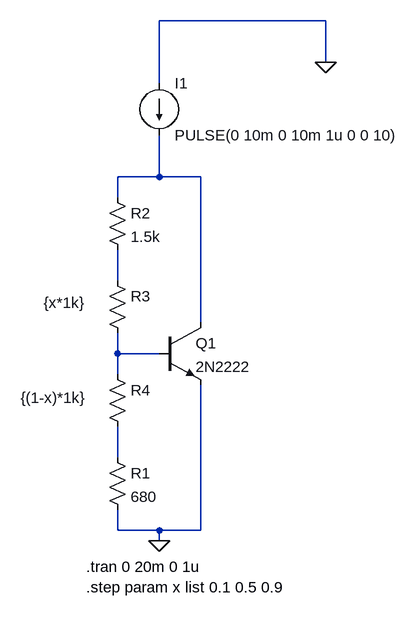
[diagram p0: schematic rubber_diode.asc]
rubber_diode.asc, the LTspice schematic file:
Version 4
SHEET 1 880 680
WIRE 432 -304 176 -304
WIRE 432 -240 432 -304
WIRE 176 -208 176 -304
WIRE 176 -64 176 -128
WIRE 176 -64 112 -64
WIRE 240 -64 176 -64
WIRE 112 -32 112 -64
WIRE 112 96 112 48
WIRE 240 160 240 -64
WIRE 112 208 112 176
WIRE 176 208 112 208
WIRE 112 240 112 208
WIRE 112 368 112 320
WIRE 112 480 112 448
WIRE 176 480 112 480
WIRE 240 480 240 256
WIRE 240 480 176 480
WIRE 176 496 176 480
FLAG 176 496 0
FLAG 432 -240 0
SYMBOL npn2 176 160 R0
SYMATTR InstName Q1
SYMATTR Value 2N2222
SYMBOL res 96 352 R0
SYMATTR InstName R1
SYMATTR Value 680
SYMBOL res 96 -48 R0
SYMATTR InstName R2
SYMATTR Value 1.5k
SYMBOL res 96 80 R0
WINDOW 3 -98 50 Left 2
SYMATTR InstName R3
SYMATTR Value {x*1k}
SYMBOL res 96 224 R0
WINDOW 3 -133 52 Left 2
SYMATTR InstName R4
SYMATTR Value {(1-x)*1k}
SYMBOL current 176 -208 R0
WINDOW 123 0 0 Left 0
WINDOW 39 0 0 Left 0
SYMATTR InstName I1
SYMATTR Value PULSE(0 10m 0 10m 1u 0 0 10)
TEXT 64 536 Left 2 !.tran 0 20m 0 1u\n.step param x list 0.1 0.5 0.9

The netlist it stands for:
* rubber_diode.asc
Q1 N001 N003 0 0 2N2222
R1 N004 0 680
R2 N001 N002 1.5k
R3 N002 N003 {x*1k}
R4 N003 N004 {(1-x)*1k}
I1 0 N001 PULSE(0 10m 0 10m 1u 0 0 10)
.model NPN NPN
.model PNP PNP
.lib standard.bjt
.tran 0 20m 0 1u
.step param x list 0.1 0.5 0.9
.backanno
.end